# EAGLE design Pi_grammer_SERIAL_UPLOAD_ADD_ON (EAGLE 7.6.0)
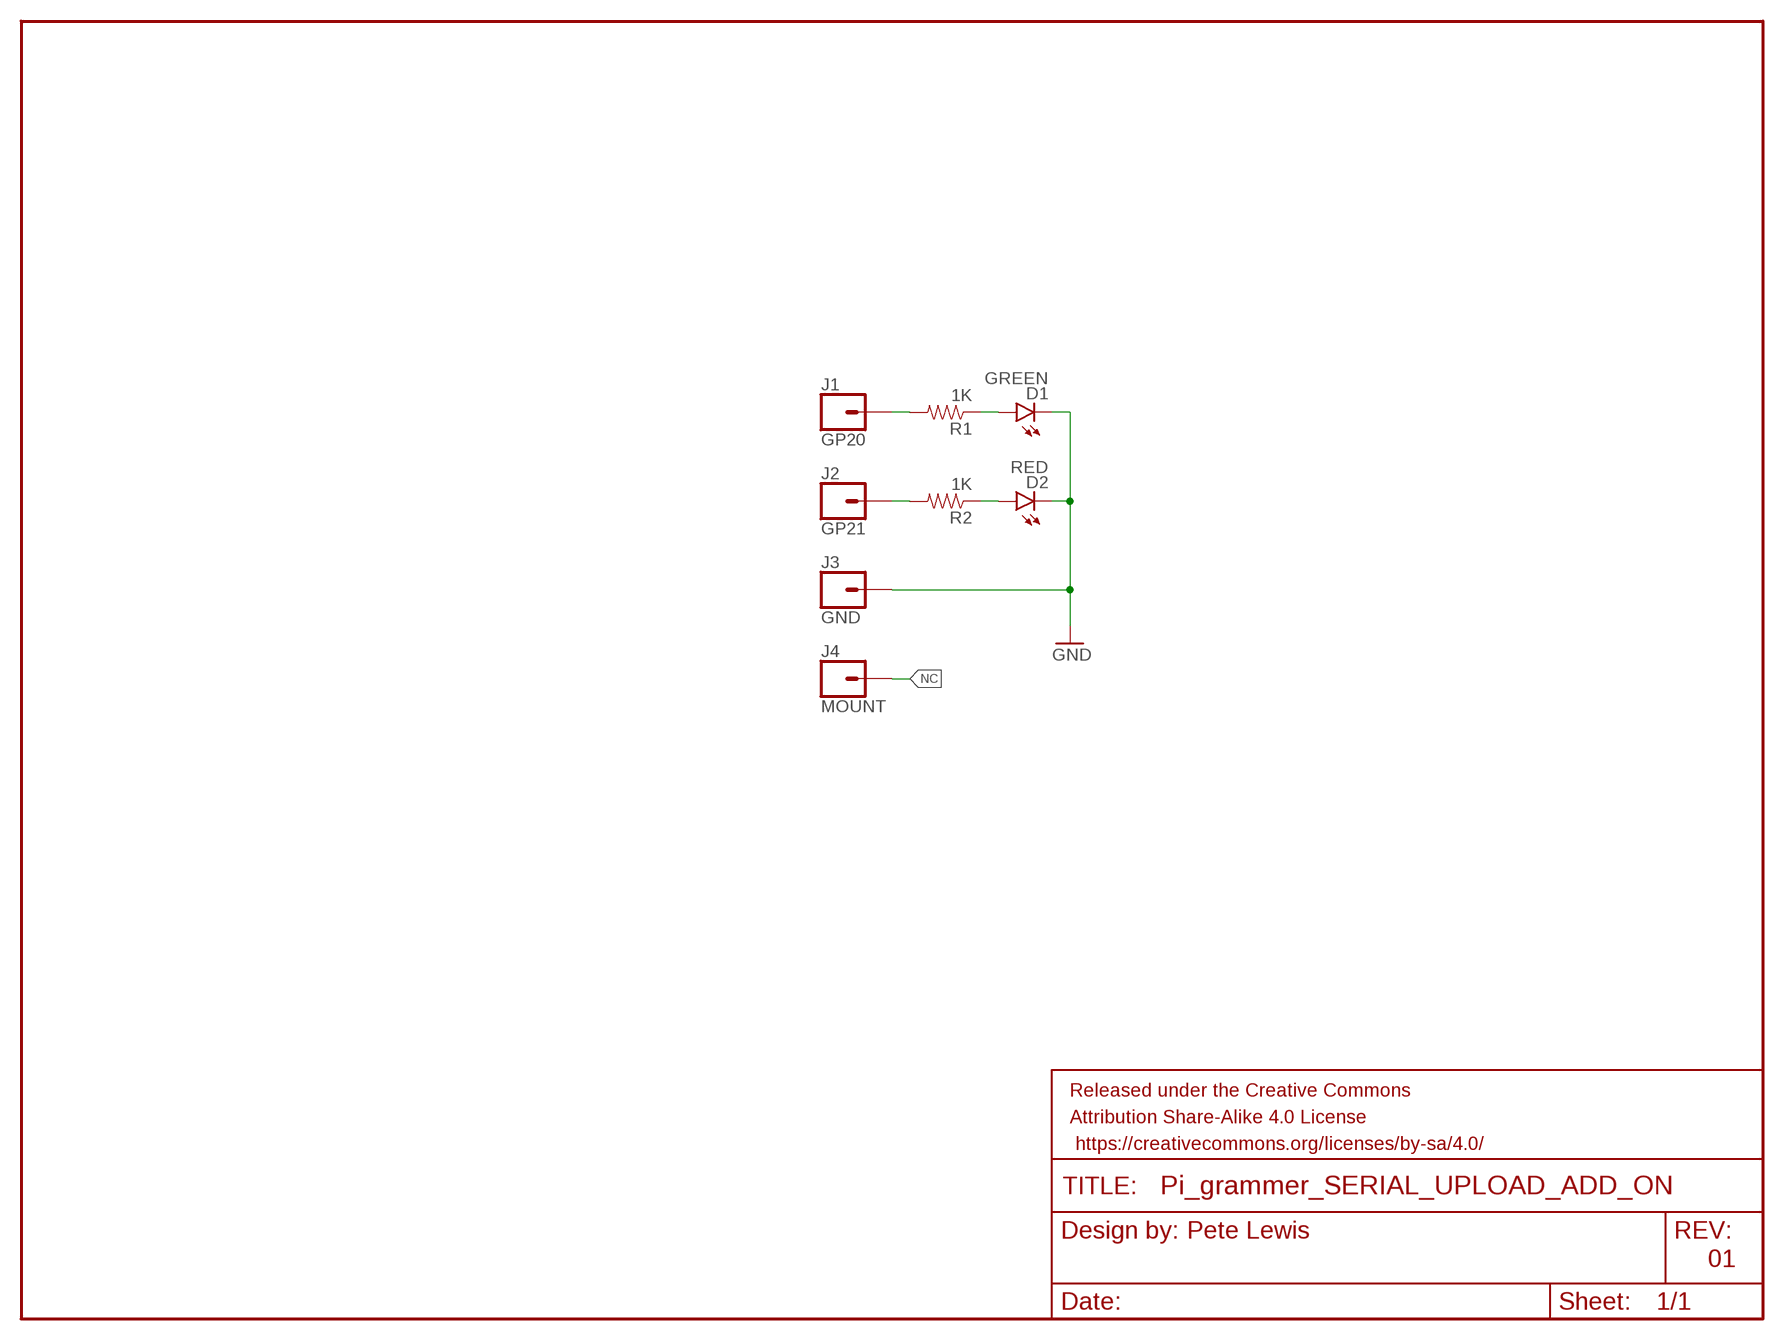
[diagram p0: schematic, sheet 1]

## Parts
D1  GREEN  LED-GREEN1206  [LED-1206]
D2  RED  LED-RED1206  [LED-1206]
FRAME1  FRAME-LETTER  [CREATIVE_COMMONS]
J1  GP20  CONN_01  [1X01]
J2  GP21  CONN_01  [1X01]
J3  GND  CONN_01  [1X01]
J4  MOUNT  CONN_01  [1X01]
R1  1K  1KOHM-1/10W-1%(0603)  [0603-RES]
R2  1K  1KOHM-1/10W-1%(0603)  [0603-RES]

## Nets
GND: D1.C D2.C J3.1
N$1: J1.1 R1.2
N$2: J2.1 R2.2
N$5: D1.A R1.1
N$8: D2.A R2.1
NC: J4.1

## Notes on the sheet
- Pete Lewis
- 01

## Library data of the parts
D1 = SparkFun-LED:LED-GREEN: Various green LEDs Green LEDs used in SFE Production 0603- DIO-00821 LARGE- DIO-00862 LILYPAD- DIO-09910; PROD_ID: DIO-00862
D2 = SparkFun-LED:LED-RED: Assorted Red LEDs LilyPad 1206- DIO-09912 1206- DIO-00809 0603- DIO-00819 "SMART" means more efficient and expensive; PROD_ID: DIO-09912
FRAME1 = SparkFun-Aesthetics:FRAME-LETTER: Schematic Frame - Letter Standard 8.5x11 US Letter frame
J1-J4 = SparkFun-Connectors:CONN_01: Single connection point. Often used as Generic Header-pin footprint for 0.1 inch spaced/style header connections On any of the 0.1 inch spaced packages, you can populate with these: Break Away Headers - Straight <https://www.sparkfun.com/products/116> (PRT-00116) Break Away Male Headers - Right Angle <https://www.sparkfun.com/products/553> (PRT-00553) Female Headers <https://www.sparkfun.com/products/115> (PRT-00115) Break Away Headers - Machine Pin <https://www.sparkfun.com/products/117> (PRT-00117) Break Away Female Headers - Swiss Machine Pin <https://www.sparkfun.com/products/743> (PRT-00743) This device is also useful as a general connection point to wire up your design to another part of your project. Our various solder wires solder well into these plated through hole pads. Hook-Up Wire - Assortment (Stranded, 22 AWG) <https://www.sparkfun.com/products/11375> (PRT-11375) Hook-Up Wire - Assortment (Solid Core, 22 AWG) <https://www.sparkfun.com/products/11367> (PRT-11367) View the entire wire category on our website here <https://www.sparkfun.com/categories/141> Special notes: SMTSO-256-ET is a "flush mount" nut for a 4-40 screw. We mostly use this on specialty testbeds; it is a nice way to connect hardware to your PCB at an adjustable hieght. Also note, the SNAP packages are for using a snappable style connector. We sell a baggie of snaps and they are also used on two LilyPad designs: Snap Assortment - 30 pack (male and female) <https://www.sparkfun.com/products/11347> (DEV-11347) LilyPad Arduino SimpleSnap <https://www.sparkfun.com/products/10941> (DEV-10941) LilyPad SimpleSnap Protoboard <https://www.sparkfun.com/products/10940> (DEV-10940)
R1 R2 = SparkFun-Resistors:1KOHM-1/10W-1%(0603): RES-07856; PROD_ID: RES-07856

## Board
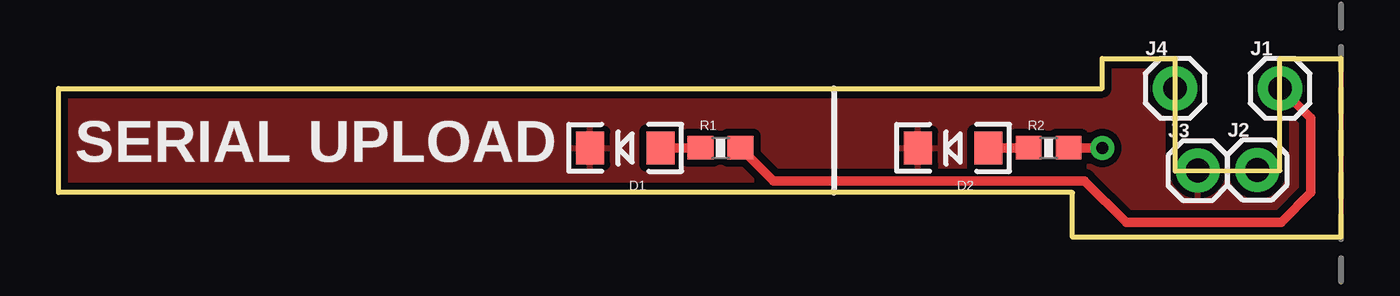
[diagram p1: board, top side]
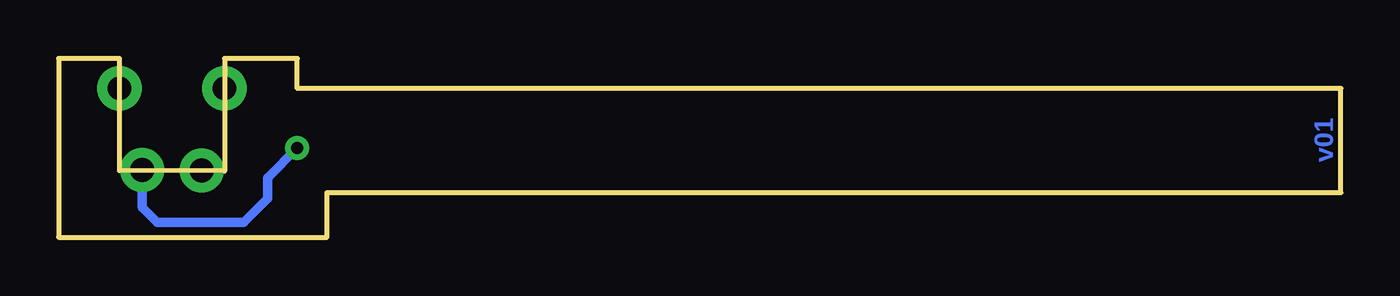
[diagram p2: board, bottom side, seen from below]

Size 54.61 x 7.62 mm. Coordinates in mm from the lower left corner, seen from the top.
Outline: 52.02,7.62 54.61,7.62 54.61,0 43.18,0 43.18,1.91 0,1.91 0,6.35 44.45,6.35 44.45,7.62 47.55,7.62 47.55,2.82 52.02,2.85 52.02,7.62
Copper layers (1*16): Top 0.035mm / dielectric 1.5mm / Bottom 0.035mm
Design rules "SparkFun-2-layer *": minimum track width 12mil, minimum drill 20mil, track to track 8mil, track to pad 8mil, pad to pad 8mil, via to via 8mil, smd to smd 8mil, copper to edge 8mil, drill to drill 8mil, minimum pad ring 12mil, minimum via ring 10mil, stop-mask expansion 4mil, vias tented up to drill 20mil, thermal gap 10mil

### Footprints (pad centres in the part's own frame; a part is rotated, then mirrored left to right if it is on the bottom)
LED-1206 = smd 1.2 x 1.4: A -1.5,0; C 1.5,0
1X01 = drill 1.016 pad 1.88: 1 0,0
0603-RES = smd 1.1 x 1: 1 -0.85,0; 2 0.85,0

### Placement (x,y rotation side)
D1  24.13,3.81 180 top
D2  38.1,3.81 180 top
FRAME1  21.59,-39.37 0 top  (outside the outline)
J1  52.02,6.35 0 top
J2  51.05,2.87 0 top
J3  48.51,2.84 0 top
J4  47.55,6.35 0 top
R1  28.19,3.81 0 top
R2  42.16,3.81 0 top

### Tracks (layer width: path | path; a pad name or v marks a point on that pad's centre or on a via)
GND
  pour Top (isolate 0.305): 0,6.35 44.45,6.35 44.45,7.62 47.5,7.62 47.5,2.79 52.07,2.79 52.07,7.62 54.61,7.62 54.61,0 43.18,0 43.18,1.91 0,1.91
N$1
  Top 0.406: J1.1 52.07,6.35 53.34,5.08 53.34,1.91 52.07,0.64 45.47,0.64 43.69,2.41 30.44,2.41 R1.2
N$2  (via drill 0.51)
  Top 0.406: v44.45,3.81 R2.2
  Bottom 0.406: J2.1 51.05,1.27 50.42,0.64 46.74,0.64 45.72,1.65 45.72,2.54 v44.45,3.81
N$5
  Top 0.406: R1.1 D1.A
N$8
  Top 0.406: R2.1 D2.A

### Text on the board
Bottom: v01
tPlace: SERIAL UPLOAD
Reference: HARDWARE # | Pi_grammer | RASPI / AVR / PROGRAMMER | POWER | STAT | SUCCESS | FAIL | FUSE BITS | FLASH HEX | LOCK BITS | GP20 | GP20 | SERIAL UPLOAD | GND | GND | GP21 | GP21 | AT42QT1010 | 0.1uF | MOSI | 10K | 10nF | 1K | TAP | MISO | TO | SCK | RST | PROGRAM | GND | SHUTDOWN / RASPI | NC
tDocu: EDGE of raspi enclosure | Pete Lewis